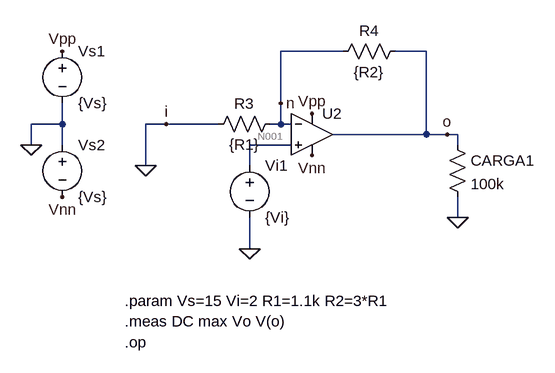
[diagram p0: schematic ex1b.asc]
ex1b.asc, the LTspice schematic file:
Version 4
SHEET 1 1448 680
WIRE 1152 16 1056 16
WIRE 1280 16 1232 16
WIRE 1056 96 1056 16
WIRE 720 128 720 96
WIRE 720 128 672 128
WIRE 880 128 848 128
WIRE 960 128 880 128
WIRE 1056 128 1056 96
WIRE 1056 128 1040 128
WIRE 1072 128 1056 128
WIRE 1280 144 1280 16
WIRE 1280 144 1136 144
WIRE 1312 144 1280 144
WIRE 1328 144 1312 144
WIRE 672 160 672 128
WIRE 720 160 720 128
WIRE 1072 160 1008 160
WIRE 1328 160 1328 144
WIRE 848 192 848 128
WIRE 1008 192 1008 160
WIRE 1328 272 1328 240
WIRE 1008 320 1008 272
FLAG 1008 320 0
FLAG 848 192 0
FLAG 1328 272 0
FLAG 672 160 0
FLAG 720 16 Vpp
FLAG 720 240 Vnn
FLAG 1312 144 o
FLAG 880 128 i
FLAG 1104 112 Vpp
FLAG 1104 176 Vnn
FLAG 1056 96 n
SYMBOL voltage 1008 176 R0
SYMATTR InstName Vi1
SYMATTR Value {Vi}
SYMBOL res 1056 112 R90
WINDOW 0 0 56 VBottom 2
WINDOW 3 32 56 VTop 2
SYMATTR InstName R3
SYMATTR Value {R1}
SYMBOL res 1248 0 R90
WINDOW 0 0 56 VBottom 2
WINDOW 3 32 56 VTop 2
SYMATTR InstName R4
SYMATTR Value {R2}
SYMBOL OpAmps\\UniversalOpAmp2 1104 144 R0
SYMATTR InstName U2
SYMATTR Value2 Avol=125 GBW=10Meg Slew=10Meg
SYMBOL voltage 720 0 R0
SYMATTR InstName Vs1
SYMATTR Value {Vs}
SYMBOL voltage 720 144 R0
SYMATTR InstName Vs2
SYMATTR Value {Vs}
SYMBOL res 1312 144 R0
SYMATTR InstName CARGA1
SYMATTR Value 100k
TEXT 816 400 Left 2 !.param Vs=15 Vi=2 R1=1.1k R2=3*R1
TEXT 816 464 Left 2 !.op
TEXT 816 432 Left 2 !.meas DC max Vo V(o)

The netlist it stands for:
* ex1b.asc
Vi1 N001 0 {Vi}
R3 n 0 {R1}
R4 o n {R2}
XU2 N001 n Vpp Vnn o level2 Avol=125 GBW=10Meg Slew=10Meg Ilimit=25m Rail=0 Vos=0 En=0 Enk=0 In=0 Ink=0 Rin=500Meg  ; pins In+ In- V+ V- OUT
Vs1 Vpp 0 {Vs}
Vs2 0 Vnn {Vs}
R§CARGA1 o 0 100k
.param Vs=15 Vi=2 R1=1.1k R2=3*R1
.op
.meas DC max Vo V(o)
.lib UniversalOpAmp2.lib
.backanno
.end

* Results of the author's LTspice run, read from the files saved beside the schematic
* Operating Point:
*   V(n001) = 2 V
*   V(n) = 1.934 V
*   V(o) = 7.738 V
*   V(vpp) = 15 V
*   V(vnn) = -15 V
*   I(R3) = 1.759 mA
*   I(R4) = 1.759 mA
*   I(Carga1) = 77.38 µA
*   I(Vi1) = -4 nA
*   I(Vs1) = -2.495 mA
*   I(Vs2) = -659.6 µA
*   Ix(u2:1) = 4 nA
*   Ix(u2:2) = 3.869 nA
*   Ix(u2:3) = 2.495 mA
*   Ix(u2:4) = -659.6 µA
*   Ix(u2:5) = -1.836 mA
* From the log:
*   Semiconductor Device Operating Points:
*                           --- Diodes ---
*   Name:    d:u2:1      d:u2:2
*   Model:    u2:x        u2:x
*   Id:     -7.27e-12   -2.28e-11
*   Vd:     -7.26e+00   -2.27e+01
*   Req:     1.00e-12    1.00e-12
*   CAP:     0.00e+00    0.00e+00